# Altium schematic sheet POWER_2.SchDoc
size A4
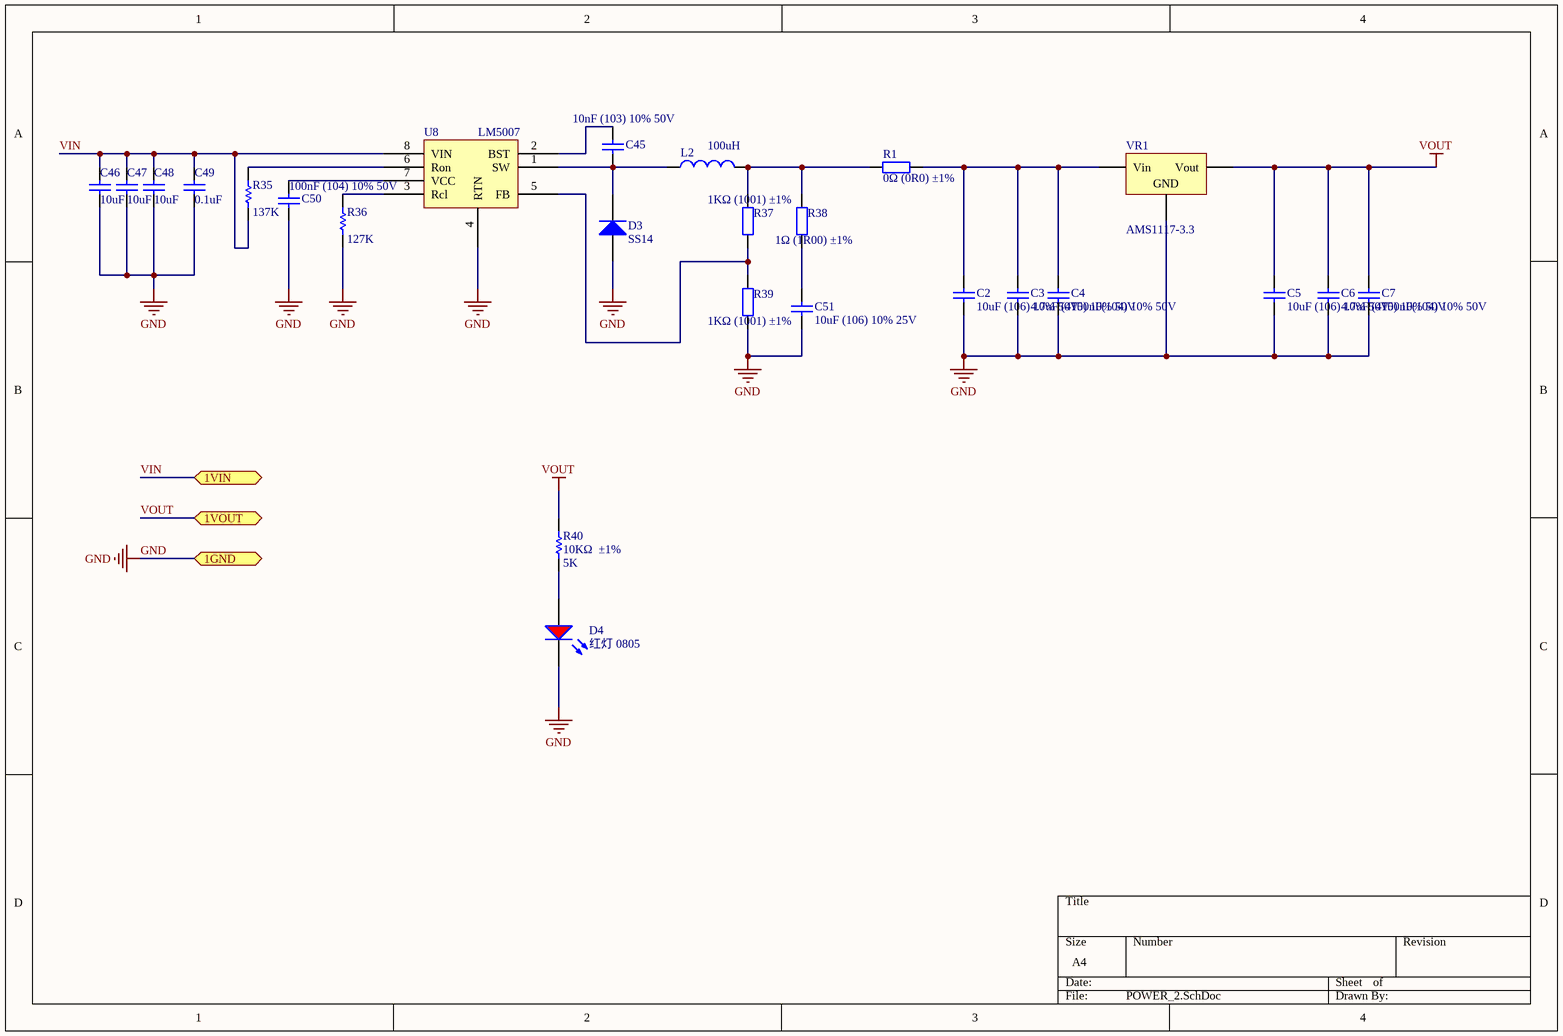
[diagram p0: POWER_2.SchDoc]

## Parts
C2  10uF (106) 10% 50V  [1206_C]
C3  4.7uF (475) 10% 50V  [1206_C]
C4  100nF(104) 10% 50V  [0805_C]
C5  10uF (106) 10% 50V  [1206_C]
C6  4.7uF (475) 10% 50V  [1206_C]
C7  100nF(104) 10% 50V  [0805_C]
C45  10nF (103) 10% 50V  [1206_C]
C46  value 10uF  [C1206]  (hidden comment: 10uF (106) ±10% 50V)
C47  value 10uF  [C1206]  (hidden comment: 10uF (106) ±10% 50V)
C48  value 10uF  [C1206]  (hidden comment: 10uF (106) ±10% 50V)
C49  value 0.1uF  [1608[0603]]  (hidden comment: 100nF (104) ±10% 50V)
C50  100nF (104) 10% 50V  [1206_C]
C51  10uF (106) 10% 25V  [0805_C]
D3  SS14  [SS14]
D4  红灯 0805  [0805_LED_S1]
L2  100uH  [Inductance220UH]
R1  0Ω (0R0) ±1%  [1206_R]
R35  value 137K  [0805_R]  (hidden comment: 137KΩ  ±1%)
R36  value 127K  [0805_R]  (hidden comment: 127KΩ (1003) ±1%)
R37  1KΩ (1001) ±1%  [0805_R]
R38  1Ω (1R00) ±1%  [0805_R]
R39  1KΩ (1001) ±1%  [0805_R]
R40  10KΩ  ±1%  value 5K  [0805_R]
U8  LM5007  [LM5007]
VR1  AMS1117-3.3  [SOT-223]

## Ports
1GND, 1VIN, 1VOUT

## Nets
GND: C2.1 C3.1 C4.1 C5.1 C6.1 C7.1 C46.1 C47.1 C48.1 C49.1 C50.1 C51.1 D3.1(A) D4.K R36.1 R39.1 U8.4(RTN) VR1.1(GND) ; port 1GND
VOUT: C5.2 C6.2 C7.2 R40.2 VR1.2(Vout) ; port 1VOUT
VIN: C46.2 C47.2 C48.2 C49.2 R35.1 U8.8(VIN) ; port 1VIN
NetC2_2: C2.2 C3.2 C4.2 R1.2 VR1.3(Vin)
NetC45_1: C45.1 D3.2(K) L2.1 U8.1(SW)
NetC45_2: C45.2 U8.2(BST)
NetC50_2: C50.2 U8.7(VCC)
NetC51_2: C51.2 R38.1
NetD4_A: D4.A R40.1
NetL2_2: L2.2 R1.1 R37.2 R38.2
NetR35_2: R35.2 U8.6(Ron)
NetR36_2: R36.2 U8.3(Rcl)
NetR37_1: R37.1 R39.2 U8.5(FB)

## Library data of the parts
C2 C5 = 1206 10uF (106) 10% 50V: 贴片电容; ComponentLink1Description: 供应商链接; ComponentLink1URL: http://www.szlcsc.com/product/details_14236.html; Package: 1206; Supplier: LC; SuppliersPartNumber: C13585
C3 C6 = 1206 4.7uF (475) 10% 50V: 贴片电容; ComponentLink1Description: 供应商链接; ComponentLink1URL: http://www.szlcsc.com/product/details_30577.html; Package: 1206; Supplier: LC; SuppliersPartNumber: C29823
C4 C7 = 0805 100nF(104) 10% 50V: 贴片电容; ComponentLink1Description: 供应商链接; ComponentLink1URL: http://www.szlcsc.com/product/details_50686.html; Package: 0805; Supplier: LC; SuppliersPartNumber: C49678
C45 = 1206 10nF (103) 10% 50V: 贴片电容; ComponentLink1Description: 供应商链接; ComponentLink1URL: http://www.szlcsc.com/product/details_2198.html; Package: 1206; Supplier: LC; SuppliersPartNumber: C1846
C46-C49 = Cap: Capacitor; Published: 8-Jun-2000; LatestRevisionDate: 17-Jul-2002; LatestRevisionNote: Re-released for DXP Platform.; PackageReference: RAD-0.3; Publisher: Altium Limited; PackageDescription: Radial Cap, Thru-Hole; 2 Leads; 0.3 in Pin Spacing
C50 = 1206 100nF (104) 10% 50V: 贴片电容; ComponentLink1Description: 供应商链接; ComponentLink1URL: http://www.szlcsc.com/product/details_25237.html; Package: 1206; Supplier: LC; SuppliersPartNumber: C24497
C51 = 0805 10uF (106) 10% 25V: 贴片电容; ComponentLink1Description: 供应商链接; ComponentLink1URL: http://www.szlcsc.com/product/details_16532.html; Package: 0805; Supplier: LC; SuppliersPartNumber: C15850
D3 = Diode: Default Diode; Published: 8-Jun-2000; LatestRevisionDate: 17-Jul-2002; LatestRevisionNote: Re-released for DXP Platform.; PackageVersion: Sep-1996; PackageReference: SMC; Publisher: Altium Limited; PackageDescription: DO-214-AB/SMC; 2 C-Bend Leads; Body 7.9 x 5.9 mm, inc. leads (LxW); Code_JEDEC: DO-214-AB
D4 = 0805 红灯: 发光二极管; ComponentLink1Description: 供应商链接; ComponentLink1URL: http://www.szlcsc.com/product/details_2668.html; Package: 0805; Supplier: LC; SuppliersPartNumber: C2295
L2 = Inductor: Code_IEC: 1005; Published: 8-Jun-2000; LatestRevisionDate: 29-May-2009; LatestRevisionNote: IPC-7351 Footprint Added.; PackageReference: 0402-A; Publisher: Altium Limited; PackageDescription: Chip Inductor; Code_JEITA: 0402; Value: 100uH
R1 = 1206 0Ω (0R0) 1%: 贴片电阻; ComponentLink1Description: 供应商链接; ComponentLink1URL: http://www.szlcsc.com/product/details_18576.html; Package: 1206; Supplier: LC; SuppliersPartNumber: C17888
R35 R36 R40 = Res1: Resistor; Published: 8-Jun-2000; LatestRevisionDate: 17-Jul-2002; LatestRevisionNote: Re-released for DXP Platform.; PackageReference: AXIAL-0.3; Publisher: Altium Limited; PackageDescription: Axial Device, Thru-Hole; 2 Leads; 0.3 in Pin Spacing
R37 R39 = 0805 1KΩ (1001) 1%: 贴片电阻; ComponentLink1Description: 供应商链接; ComponentLink1URL: http://www.szlcsc.com/product/details_18201.html; Package: 0805; Supplier: LC; SuppliersPartNumber: C17513
R38 = 0805 1Ω (1R00) 1%: 贴片电阻; ComponentLink1Description: 供应商链接; ComponentLink1URL: http://www.szlcsc.com/product/details_26014.html; Package: 0805; Supplier: LC; SuppliersPartNumber: C25271
VR1 = SOT-223 AMS1117-3.3: 低压差线性稳压(LDO); ComponentLink1Description: 供应商链接; ComponentLink1URL: http://www.szlcsc.com/product/details_6652.html; Package: SOT-223; Supplier: LC; SuppliersPartNumber: C6186